# EAGLE design OLSD_Arduino_4B (EAGLE 5.10)
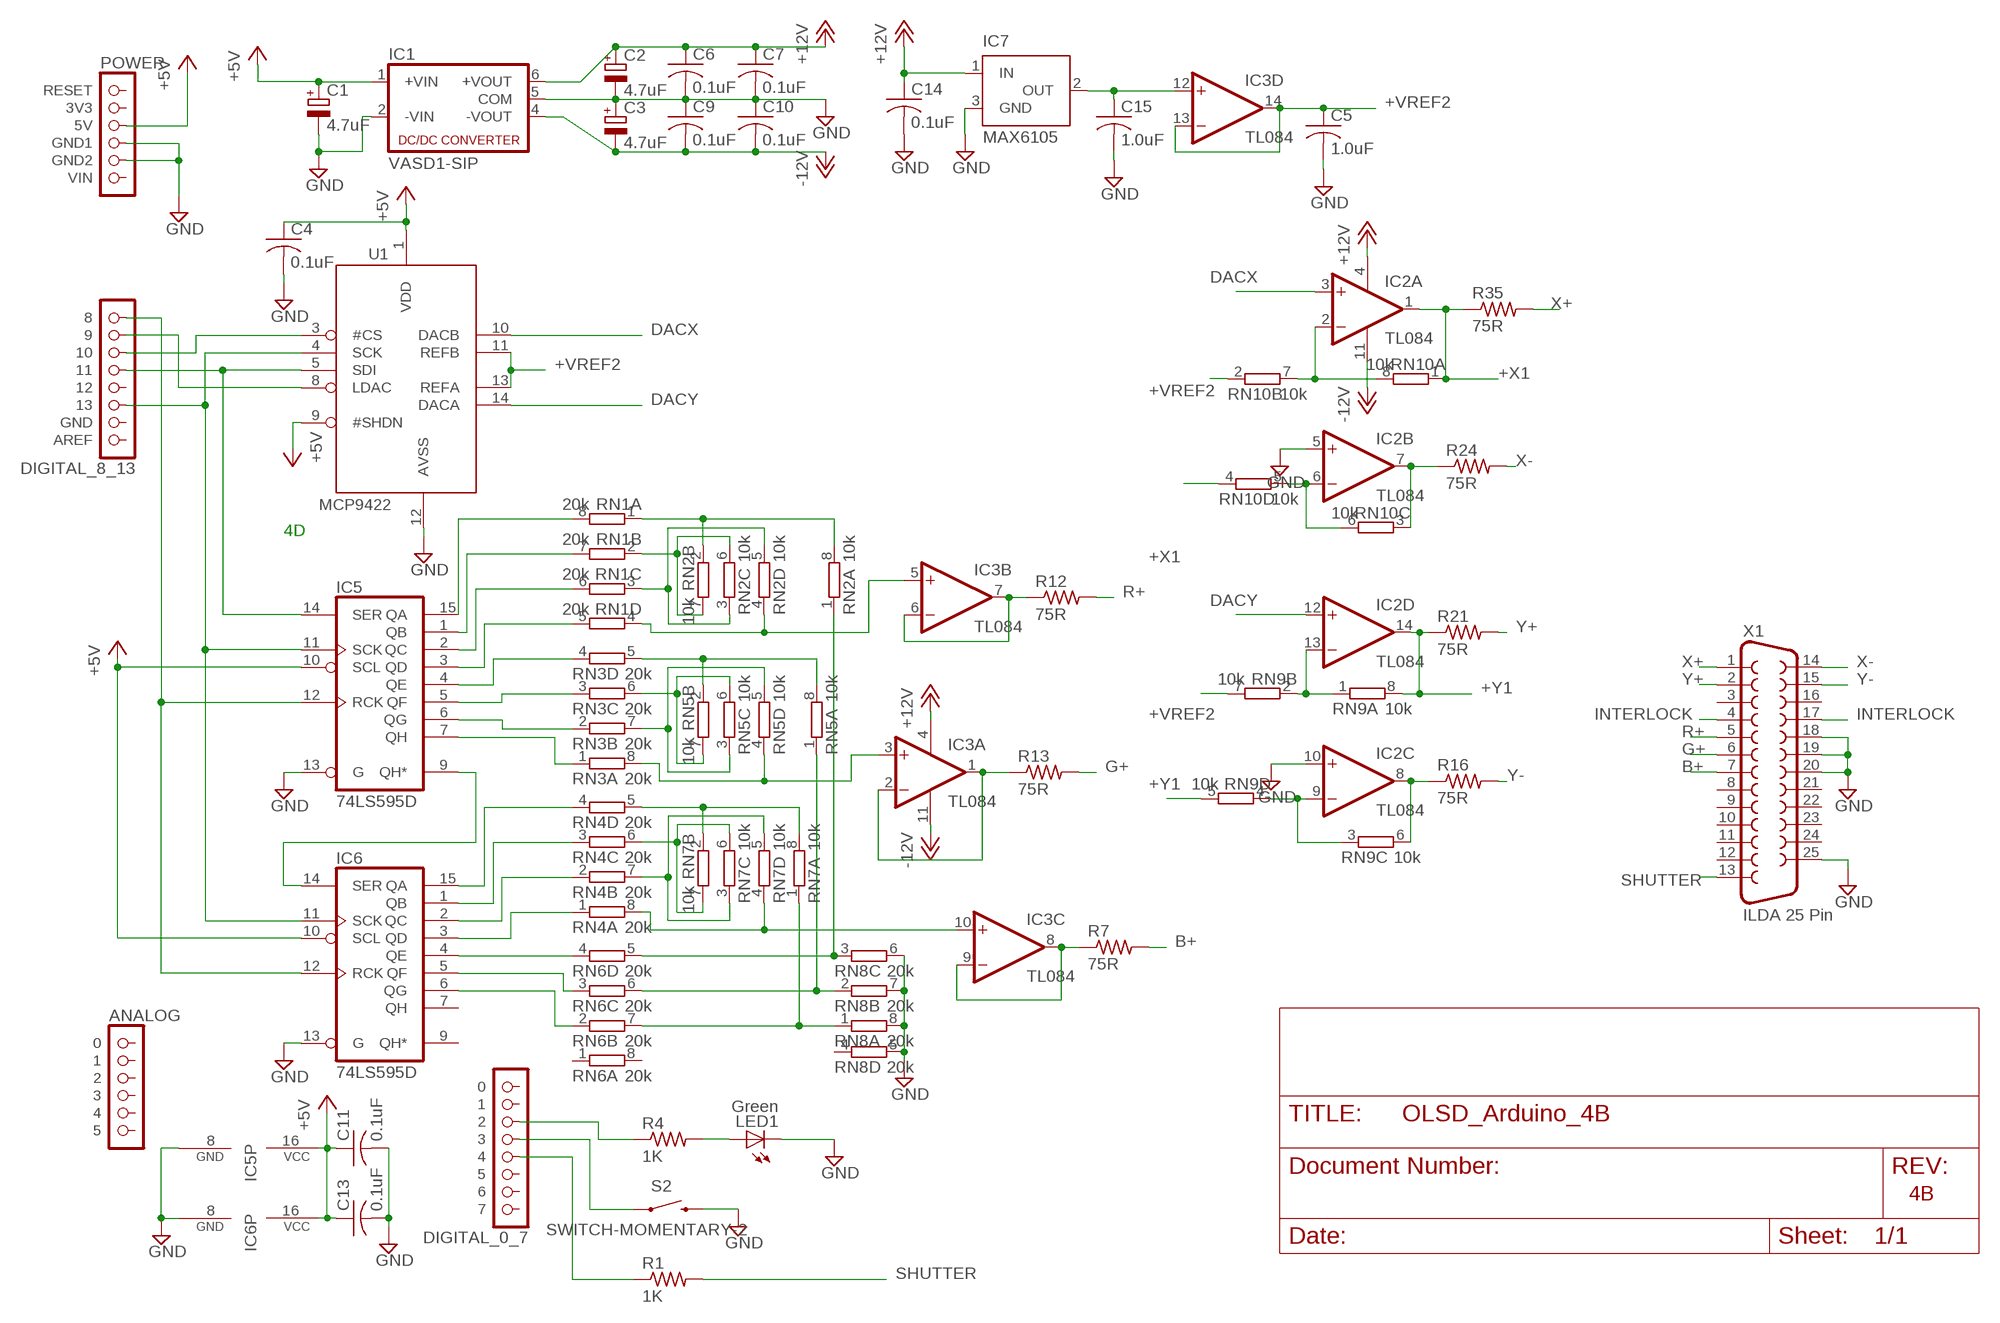
[diagram p0: schematic, sheet 1]

## Parts
C1  4.7uF  CPOL-EUE1.8-4  [E1,8-4]
C2  4.7uF  CPOL-EUE1.8-4  [E1,8-4]
C3  4.7uF  CPOL-EUE1.8-4  [E1,8-4]
C4  0.1uF  C-USC0603  [C0603]
C5  1.0uF  C-USC0603  [C0603]
C6  0.1uF  C-USC0603  [C0603]
C7  0.1uF  C-USC0603  [C0603]
C9  0.1uF  C-USC0603  [C0603]
C10  0.1uF  C-USC0603  [C0603]
C11  0.1uF  C-USC0603  [C0603]
C13  0.1uF  C-USC0603  [C0603]
C14  0.1uF  C-USC0603  [C0603]
C15  1.0uF  C-USC0603  [C0603]
IC1  VASD1-SIP  NMA  [NMA]
IC2  TL084  [SOIC-14]
IC3  TL084  [SOIC-14]
IC5  74LS595D  [SO16]
IC6  74LS595D  [SO16]
IC7  MAX6105  MAX6520  [SOT23]
LED1  Green  LED0603  [LED-0603]
R1  1K  R-US_R0603  [R0603]
R4  1K  R-US_R0603  [R0603]
R7  75R  R-US_R0603  [R0603]
R12  75R  R-US_R0603  [R0603]
R13  75R  R-US_R0603  [R0603]
R16  75R  R-US_R0603  [R0603]
R21  75R  R-US_R0603  [R0603]
R24  75R  R-US_R0603  [R0603]
R35  75R  R-US_R0603  [R0603]
RN1  20k  4R-NEXB38V  [EXB38V]
RN2  10k  4R-NEXB38V  [EXB38V]
RN3  20k  4R-NEXB38V  [EXB38V]
RN4  20k  4R-NEXB38V  [EXB38V]
RN5  10k  4R-NEXB38V  [EXB38V]
RN6  20k  4R-NEXB38V  [EXB38V]
RN7  10k  4R-NEXB38V  [EXB38V]
RN8  20k  4R-NEXB38V  [EXB38V]
RN9  10k  4R-NEXB38V  [EXB38V]
RN10  10k  4R-NEXB38V  [EXB38V]
S2  SWITCH-MOMENTARY-2  [TACTILE_SWITCH_TALL]
U1  MCP4922  [SOIC-14]
U$1  POWER  [1X06]
U$2  ANALOG  [1X06]
U$3  DIGITAL_0_7  [1X08]
U$4  DIGITAL_8_13  [1X08]
X1  ILDA 25 Pin  F25D  [F25D]

## Nets
#COLOR_LATCH: IC5.12(RCK) IC6.12(RCK) U$4.8
#CS_DAC: U1.3(#CS) U$4.6
#LDAC: U1.8(LDAC) U$4.7
+5V: C1.+ C4.1 C11.1 C13.1 IC1.1(+VIN) IC5.10(SCL) IC5.16(VCC) IC6.10(SCL) IC6.16(VCC) U1.1(VDD) U1.9(#SHDN) U$1.3(5V)
+12V: C2.+ C6.1 C7.1 C14.1 IC1.6(+VOUT) IC2.4(A:V+) IC3.4(A:V+) IC7.1(IN)
+VREF: C15.1 IC3.12(D:+IN) IC7.2(OUT)
+VREF2: C5.1 IC3.13(D:-IN) IC3.14(D:OUT) RN9.7 RN10.2 U1.11(REFB) U1.13(REFA)
+X1: IC2.1(A:OUT) R35.1 RN10.1 RN10.4
+Y1: IC2.14(D:OUT) R21.1 RN9.5 RN9.8
-12V: C3.- C9.2 C10.2 IC1.4(-VOUT) IC2.11(A:V-) IC3.11(A:V-)
B1+: IC3.8(C:OUT) IC3.9(C:-IN) R7.1
B+: R7.2 X1.7
DACX: IC2.3(A:+IN) U1.10(DACB)
DACY: IC2.12(D:+IN) U1.14(DACA)
G1+: IC3.1(A:OUT) IC3.2(A:-IN) R13.1
G+: R13.2 X1.6
GND: C1.- C2.- C3.+ C4.2 C5.2 C6.2 C7.2 C9.1 C10.1 C11.2 C13.2 C14.2 C15.2 IC1.2(-VIN) IC1.5(COM) IC2.5(B:+IN) IC2.10(C:+IN) IC5.8(GND) IC5.13(G) IC6.8(GND) IC6.13(G) IC7.3(GND) LED1.C RN8.5 RN8.6 RN8.7 RN8.8 S2.B2 U1.12(AVSS) U$1.4(GND1) U$1.5(GND2) X1.18 X1.19 X1.20 X1.25
INTERLOCK: X1.4 X1.17
MOSI: IC5.14(SER) U1.5(SDI) U$4.5
N$1: RN1.1 RN2.2 RN2.8
N$3: IC5.9(QH*) IC6.14(SER)
N$4: RN3.5 RN5.2 RN5.8
N$5: RN3.6 RN5.6 RN5.7
N$6: RN3.7 RN5.3 RN5.5
N$7: IC3.3(A:+IN) RN3.8 RN5.4
N$8: IC5.15(QA) RN1.8
N$9: IC5.1(QB) RN1.7
N$10: IC5.2(QC) RN1.6
N$11: IC5.3(QD) RN1.5
N$12: IC5.4(QE) RN3.4
N$13: R4.1 U$3.6
N$14: RN5.1 RN6.6 RN8.2
N$15: IC5.5(QF) RN3.3
N$16: IC5.6(QG) RN3.2
N$17: R1.1 U$3.4
N$18: IC3.10(C:+IN) RN4.8 RN7.4
N$20: LED1.A R4.2
N$23: RN1.2 RN2.6 RN2.7
N$24: RN1.3 RN2.3 RN2.5
N$26: IC6.15(QA) RN4.4
N$27: RN2.1 RN6.5 RN8.3
N$28: IC6.1(QB) RN4.3
N$29: IC6.2(QC) RN4.2
N$30: IC2.2(A:-IN) RN10.7 RN10.8
N$31: IC2.13(D:-IN) RN9.1 RN9.2
N$32: IC6.3(QD) RN4.1
N$33: S2.A2 U$3.5
N$34: RN4.5 RN7.2 RN7.8
N$35: IC2.6(B:-IN) RN10.5 RN10.6
N$36: IC2.9(C:-IN) RN9.3 RN9.4
N$37: RN4.6 RN7.6 RN7.7
N$38: RN4.7 RN7.3 RN7.5
N$39: IC3.5(B:+IN) RN1.4 RN2.4
N$42: IC6.4(QE) RN6.4
N$43: IC6.5(QF) RN6.3
N$44: IC6.6(QG) RN6.2
N$45: RN6.7 RN7.1 RN8.1
N$47: IC5.7(QH) RN3.1
R1+: IC3.6(B:-IN) IC3.7(B:OUT) R12.1
R+: R12.2 X1.5
SCK: IC5.11(SCK) IC6.11(SCK) U1.4(SCK) U$4.3
SHUTTER: R1.2 X1.13
X1-: IC2.7(B:OUT) R24.1 RN10.3
X+: R35.2 X1.1
X-: R24.2 X1.14
Y1-: IC2.8(C:OUT) R16.1 RN9.6
Y+: R21.2 X1.2
Y-: R16.2 X1.15
Unconnected: IC6.7(QH) IC6.9(QH*) RN6.1 RN6.8 RN8.4 U$1.1(RESET) U$1.2(3V3) U$1.6(VIN) U$2.1 U$2.2 U$2.3 U$2.4 U$2.5 U$2.6 U$3.1 U$3.2 U$3.3 U$3.7 U$3.8 U$4.1(AREF) U$4.2(GND) U$4.4 X1.3 X1.8 X1.9 X1.10 X1.11 X1.12 X1.16 X1.21 X1.22 X1.23 X1.24

## Notes on the sheet
- 4D
- 4B

## Library data of the parts
C1-C3 = rcl:CPOL-EU: POLARIZED CAPACITOR, European symbol
C4-C7 C9-C11 C13-C15 = adafruit:C-US: CAPACITOR, American symbol
IC1 = dc-dc-converter:NMA: DC-DC CONVERTER
IC2 IC3 = favreau:TL084: Texas Instruments TL084 JFET General Purpose Op-Amp
IC5 IC6 = 74xx-us:74*595: 8-bit SHIFT REGISTER, output latch
IC7 = maxim:MAX6520: 1.2V Voltage Reference 50ppm/°C, SOT23, 3-Terminal Source: http://datasheets.maxim-ic.com/en/ds/MAX6520.pdf
LED1 = SparkFun:LED: LEDs Standard schematic elements and footprints for 5mm, 3mm, 1206, and 0603 sized LEDs. 5mm - Spark Fun Electronics SKU : COM-00529 (and others)
R1 R4 R7 R12 R13 R16 R21 R24 R35 = resistor:R-US_: RESISTOR, American symbol
RN1-RN10 = resistor-dil:4R-N: Array Chip Resistor Source: RS Component / Phycomp
S2 = SparkFun:SWITCH-MOMENTARY-2
U1 = favreau:MCP4922
U$1 = arduino:POWER
U$2 = arduino:ANALOG
U$3 = arduino:DIGITAL_0_7
U$4 = arduino:DIGITAL_8_13
X1 = SparkFun:F25: D-SUB 25 25 Pin male connector. PCB edge mount for regular PCB thicknesses. This connector will connect directly to the back of a PC parallel port or through a normal DB25 extension cable (M/F). SKU: PRT-08287

## Board
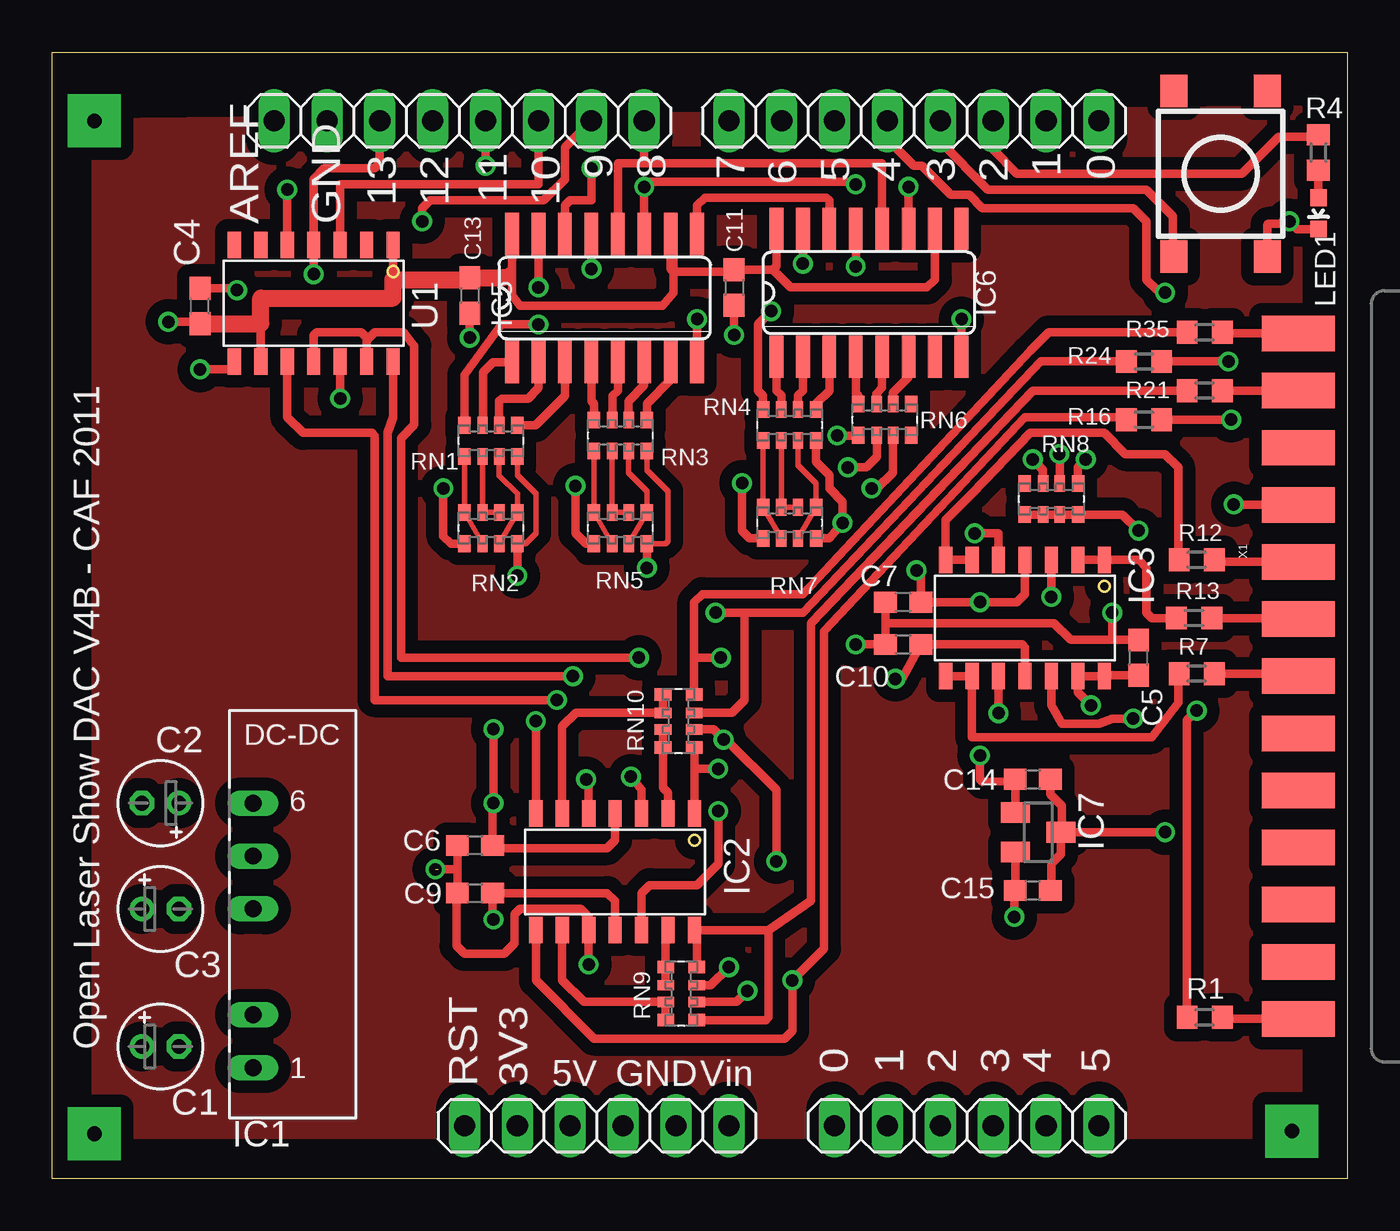
[diagram p1: board, top side]
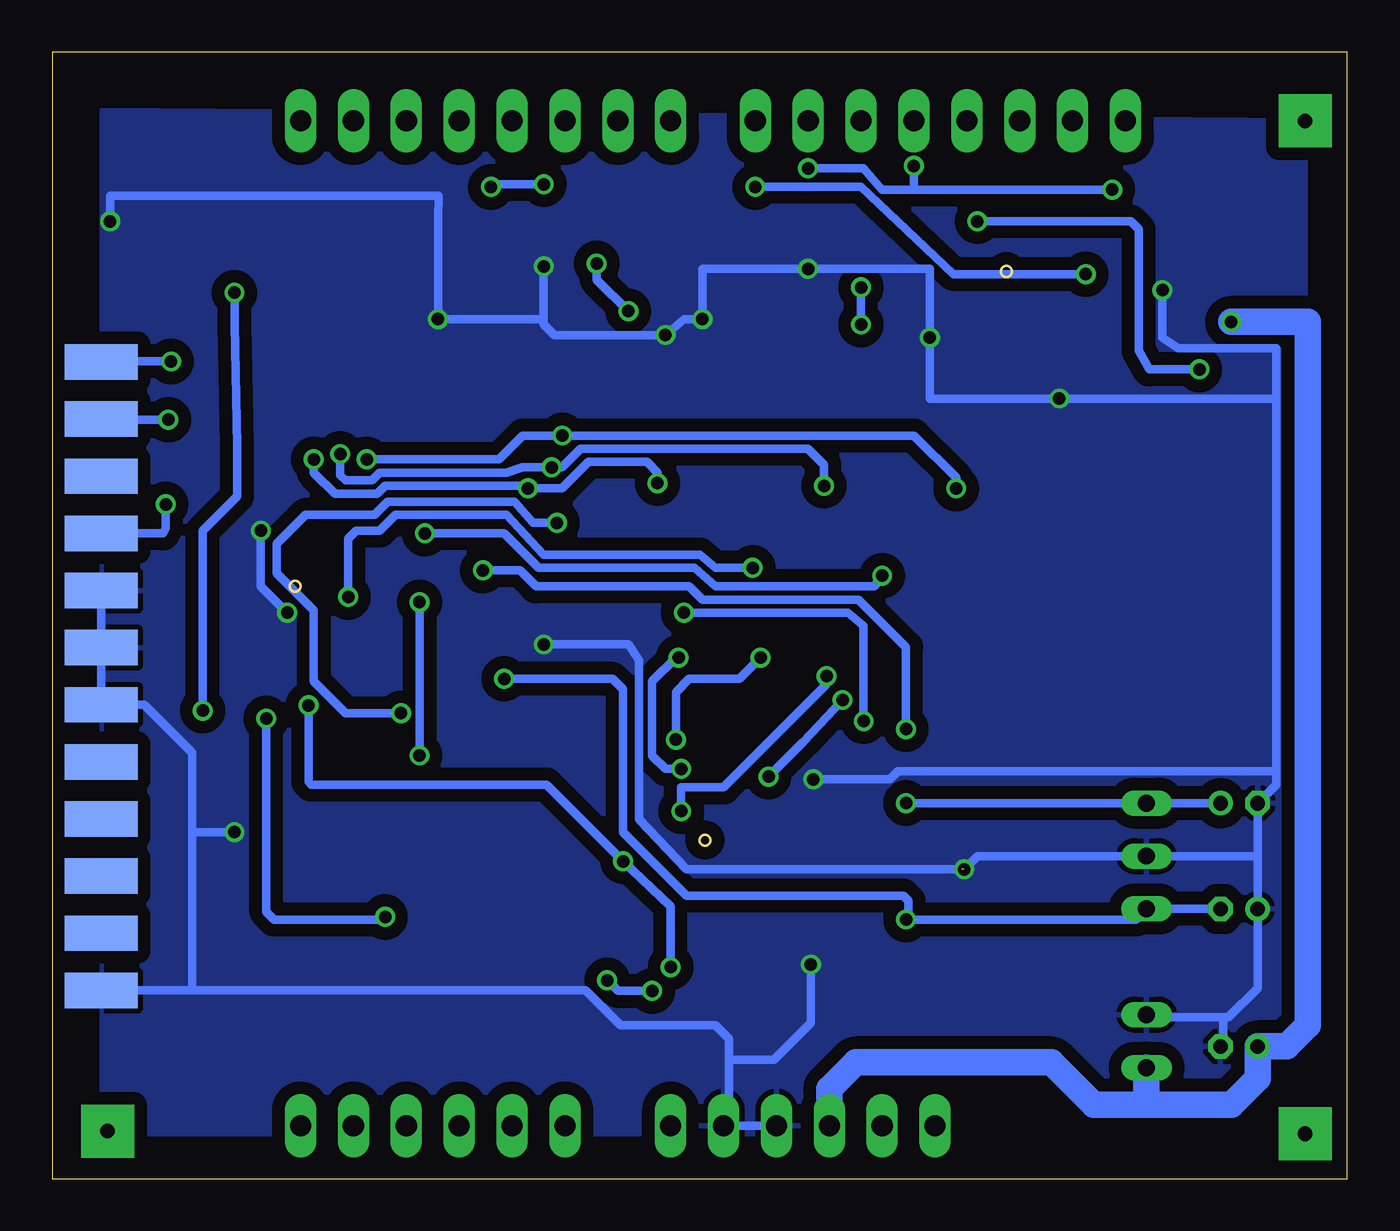
[diagram p2: board, bottom side, seen from below]

Size 62.23 x 54.1 mm. Coordinates in mm from the lower left corner, seen from the top.
Outline: 0,54.1 62.23,54.1 62.23,0 0,0 0,54.1
Copper layers (1*16): Top 0.0356mm / dielectric 1.5011mm / Bottom 0.0356mm
Design rules "LaenPCBOrder": minimum track width 6mil, minimum drill 13mil, track to track 6mil, track to pad 6mil, pad to pad 6mil, via to via 6mil, smd to smd 6mil, copper to edge 15mil, drill to drill 6mil, minimum pad ring 7mil, minimum via ring 7mil, stop-mask expansion 4mil, vias tented up to drill 0mil, thermal gap 10mil

### Footprints (pad centres in the part's own frame; a part is rotated, then mirrored left to right if it is on the bottom)
E1,8-4 = drill 0.711 pad 1.168 round: + -0.889,0 | drill 0.711 pad 1.168 octagon: - 0.889,0
C0603 = smd 1.1 x 1: 1 -0.85,0; 2 0.85,0
NMA = drill 0.813 long: 1 0,6.35; 2 0,3.81; 4 0,-1.27; 5 0,-3.81; 6 0,-6.35
SOIC-14 = smd 1.27 x 0.635: 1 -0.762,-0.508; 2 -0.762,-1.778; 3 -0.762,-3.048; 4 -0.762,-4.318; 5 -0.762,-5.588; 6 -0.762,-6.858; 7 -0.762,-8.128; 8 4.826,-8.128; 9 4.826,-6.858; 10 4.826,-5.588; 11 4.826,-4.318; 12 4.826,-3.048; 13 4.826,-1.778; 14 4.826,-0.508
SO16 = smd 0.66 x 2.032: 1 -4.445,-3.073; 2 -3.175,-3.073; 3 -1.905,-3.073; 4 -0.635,-3.073; 5 0.635,-3.073; 6 1.905,-3.073; 7 3.175,-3.073; 8 4.445,-3.073; 9 4.445,3.073; 10 3.175,3.073; 11 1.905,3.073; 12 0.635,3.073; 13 -0.635,3.073; 14 -1.905,3.073; 15 -3.175,3.073; 16 -4.445,3.073
SOT23 = smd 1 x 1.4: 1 -0.95,-1.1; 2 0.95,-1.1; 3 0,1.1
LED-0603 = smd 0.8 x 0.8: A 0,-0.75; C 0,0.75
R0603 = smd 1 x 1.1: 1 -0.85,0; 2 0.85,0
EXB38V = smd 0.6 x 0.8: 1 -1.275,-0.75; 4 1.275,-0.75; 5 1.275,0.75; 8 -1.275,0.75 | smd 0.5 x 0.8: 2 -0.4,-0.75; 3 0.4,-0.75; 6 0.4,0.75; 7 -0.4,0.75
TACTILE_SWITCH_TALL = smd 1.55 x 1.3: A1 -3.975,-2.25; A2 3.975,-2.25; B1 -3.975,2.25; B2 3.975,2.25
1X06 = drill 1.016 long: 1 -6.35,0; 2 -3.81,0; 3 -1.27,0; 4 1.27,0; 5 3.81,0; 6 6.35,0
1X08 = drill 1.016 long: 1 -8.89,0; 2 -6.35,0; 3 -3.81,0; 4 -1.27,0; 5 1.27,0; 6 3.81,0; 7 6.35,0; 8 8.89,0
F25D = smd 1.7 x 3.5: 1 -16.459,-6.045; 2 -13.716,-6.045; 3 -10.973,-6.045; 4 -8.23,-6.045; 5 -5.486,-6.045; 6 -2.743,-6.045; 7 0,-6.045; 8 2.743,-6.045; 9 5.486,-6.045; 10 8.23,-6.045; 11 10.973,-6.045; 12 13.716,-6.045; 13 16.459,-6.045 | smd 1.7 x 3.5 bottom: 14 -15.088,-6.045; 15 -12.344,-6.045; 16 -9.601,-6.045; 17 -6.858,-6.045; 18 -4.115,-6.045; 19 -1.372,-6.045; 20 1.372,-6.045; 21 4.115,-6.045; 22 6.858,-6.045; 23 9.601,-6.045; 24 12.344,-6.045; 25 15.088,-6.045

### Placement (x,y rotation side)
C1  5.21,6.35 0 top
C2  5.21,18.03 180 top
C3  5.21,12.95 0 top
C4  7.11,41.91 90 top
C5  52.2,25.02 90 top
C6  20.32,16 180 top
C7  40.89,27.69 180 top
C9  20.32,13.72 0 top
C10  40.89,25.65 0 top
C11  32.77,42.8 270 top
C13  20.07,42.42 270 top
C14  47.12,19.18 0 top
C15  47.12,13.84 0 top
IC1  9.65,11.68 180 top
IC2  31.37,16.76 270 top
IC3  51.05,28.96 270 top
IC5  26.54,42.29 0 top
IC6  39.24,42.55 0 top
IC7  47.37,16.64 270 top
LED1  60.83,46.35 180 top
R1  55.37,7.75 0 top
R4  60.83,49.28 270 top
R7  54.99,24.26 0 top
R12  54.99,29.72 0 top
R13  54.86,26.92 0 top
R16  52.45,36.45 0 top
R21  55.37,37.85 0 top
R24  52.45,39.24 0 top
R35  55.37,40.64 0 top
RN1  21.08,35.43 0 top
RN2  21.08,31.24 0 top
RN3  27.3,35.69 180 top
RN4  35.43,36.2 180 top
RN5  27.3,31.24 0 top
RN6  40.01,36.45 180 top
RN7  35.43,31.5 0 top
RN8  48.01,32.64 180 top
RN9  30.23,8.89 270 top
RN10  30.1,21.97 90 top
S2  56.13,48.26 270 top
U1  16.89,44.07 270 top
U$1  26.16,2.54 0 top
U$2  43.94,2.54 0 top
U$3  41.4,50.8 0 top
U$4  19.56,50.8 0 top
X1  65.91,24.13 270 top

### Tracks (layer width: path | path; a pad name or v marks a point on that pad's centre or on a via)
#COLOR_LATCH
  Top 0.406: 28.45,48.77 39.88,48.77 IC6.12 | 28.45,48.77 U$4.8 | 28.45,48.77 27.18,48.77 IC5.12
#CS_DAC
  Top 0.406: U1.3 13.84,47.75 23.37,47.75 U$4.6
#LDAC  (via drill 0.6)
  Top 0.406: 8.76,39.12 U1.8 8.76,38.86 v7.11,38.86 | U$4.7 24.64,49.53 24.64,48.01 23.62,46.99 18.16,46.99 17.78,46.61 v17.78,45.97
  Bottom 0.406: v17.78,45.97 10.41,45.97 10.03,45.59 10.03,39.75 9.53,38.86 v7.11,38.86
+5V  (via drill 0.6)
  Top 0.406: 21.68,43.27 22.1,43.69 IC5.16 22.1,42.42 22.48,41.91 29.34,41.91 29.84,42.55 29.84,43.56 | 34.63,43.65 C11.1 32.68,43.56 29.84,43.56 | 34.63,43.65 34.8,43.81 IC6.16 | v5.59,41.15 7.07,41.15 C4.1 | 29.84,43.56 29.84,45.24 IC5.10 29.72,43.69 29.84,43.56 | IC6.10 42.42,43.18 42.04,42.8 35.48,42.8 34.63,43.65 | 10.03,41.06 U1.9 | 16.38,43.18 U1.1 | 20.07,43.18 C13.1
  Top 0.813: C13.1 21.68,43.27 | C4.1 10.03,41.06 10.03,42.29 16.38,42.29 16.38,43.18 20.07,43.18
  Bottom 1.27: U$1.3 24.89,4.32 23.62,5.59 14.22,5.59 12.19,3.56 9.65,3.56 | 9.65,3.56 5.59,3.56 4.32,4.83 C1.+ 2.92,6.35 1.91,7.37 1.91,41.15 v5.59,41.15 | 9.65,3.56 IC1.1
+12V  (via drill 0.6)
  Top 0.406: C7.1 v44.58,27.69 46.35,27.69 46.74,28.07 IC3.4 | C7.1 41.78,27.6 | IC2.4 27.05,16.26 26.67,15.88 21.3,15.88 C6.1 21.17,18 v21.21,18.03 v21.21,21.59 | 46.27,18.67 IC7.1 | 46.27,18.67 C14.1 | v44.58,20.32 44.58,19.18 44.7,19.05 46.23,19.09 46.27,18.67 | C7.1 41.74,29 v41.53,29.21
  Bottom 0.406: C2.+ IC1.6 v21.21,18.03 | v21.21,21.59 21.21,25.53 23.5,27.81 30.99,27.81 31.62,28.45 38.99,28.45 39.75,29.21 v41.53,29.21 | v44.58,27.69 v44.58,20.32
+VREF  (via drill 0.6)
  Top 0.406: IC7.2 C15.1 46.23,13.8 v46.23,12.57 | IC3.12 48.01,22.73 48.51,21.84 50.29,21.84 50.93,22.1 v51.94,22.1
  Bottom 0.406: v51.94,22.1 51.94,12.83 51.56,12.45 46.35,12.45 v46.23,12.57
+VREF2  (via drill 0.6)
  Top 0.406: U1.11 12.57,40.51 12.7,40.64 14.86,40.64 15.11,40.39 U1.13 15.11,40.26 15.49,40.64 16.89,40.64 17.27,40.13 17.4,40.01 17.4,36.2 16.76,35.56 16.76,25.02 v28.19,25.02 | v49.91,22.73 49.28,23.37 IC3.13 IC3.14 50.55,24.17 C5.1 | RN10.2 31.77,21.57 v32.26,21.08 32.38,21.08 34.8,18.67 v34.8,15.24 | RN9.7 31.64,9.29 v32.51,10.16
  Bottom 0.406: v49.91,22.73 49.91,19.05 49.78,18.92 38.48,18.92 v34.8,15.24 32.51,13.08 v32.51,10.16 | 28.32,25.02 v28.19,25.02 29.21,24 31.62,24 32.26,23.37 v32.26,21.08
+X1  (via drill 0.6)
  Top 0.406: IC2.1 30.86,19.56 | 30.86,19.56 30.86,20.68 RN10.1 | R35.1 47.88,40.64 46.99,39.75 36.07,28.07 31.24,28.07 30.85,27.67 RN10.4 30.85,25.01 30.86,25.02 v32.13,25.02 | v32,19.68 30.99,19.68 30.86,19.56
  Bottom 0.406: v32.13,25.02 32.26,25.02 33.4,23.88 33.4,20.32 32.77,19.68 v32,19.68
+Y1
  Top 0.406: 34.42,11.94 IC2.14 30.98,11.94 RN9.8 | 34.42,11.94 36.45,13.34 36.45,26.67 47.12,37.85 R21.1 | RN9.5 34.28,7.62 34.42,7.75 34.42,11.94
-12V  (via drill 0.6)
  Top 0.406: IC3.11 46.74,25.53 46.61,25.65 C10.2 40.85,24.04 v40.51,24 | v21.21,12.45 21.17,12.48 C9.2 26.67,13.72 27.05,13.34 IC2.11
  Bottom 0.406: C3.- IC1.4 10.16,12.45 21.08,12.45 | 21.08,12.45 v21.21,12.45 | 21.08,12.45 21.08,13.34 21.34,13.59 31.75,13.59 34.8,16.64 34.8,23.5 35.31,24 v40.51,24
B1+
  Top 0.406: IC3.8 IC3.9 44.2,21.21 52.83,21.21 54.1,22.86 54.1,24.22 R7.1
B+
  Top 0.406: R7.2 59.74,24.26 X1.7
DACX  (via drill 0.6)
  Top 0.406: IC2.3 28.32,18.67 v27.81,19.3 | v24.26,22.99 15.49,22.99 15.49,35.69 15.37,35.81 12.06,35.81 11.3,36.58 U1.10
  Bottom 0.406: v27.81,19.3 26.16,20.95 v24.26,22.99
DACY  (via drill 0.6)
  Top 0.406: IC2.12 28.32,13.72 28.7,14.1 30.99,14.1 32,15.11 v32,17.65 | v25.02,24.13 16.13,24.13 16.13,35.81 16.38,36.58 U1.14
  Bottom 0.406: v32,17.65 32,18.8 29.97,18.8 25.02,23.75 v25.02,24.13
G1+
  Top 0.406: IC3.2 IC3.1 52.2,29.72 52.58,29.34 52.58,27.18 52.83,26.92 R13.1
G+
  Top 0.406: R13.2 59.82,26.92 X1.6
GND  (via drill 0.6)  (1 unrouted)
  Top 0.406: 40.04,26.54 C10.1 v38.61,25.65 | 40.04,26.54 C7.2 | 19.47,14.86 C9.1 19.43,13.68 19.43,11.18 19.81,10.79 21.72,10.79 22.23,11.3 22.23,12.7 22.48,12.95 25.4,12.95 25.78,12.57 IC2.10 v25.78,10.29 | 19.47,14.86 C6.2 | v18.41,14.86 19.47,14.86 | C4.2 8.8,42.76 v8.89,42.67 | v13.84,37.47 U1.12 | v20.07,40.39 C13.2 | v25.91,43.69 IC5.13 | v30.99,41.27 IC5.8 | v32.77,40.51 C11.2 | v38.61,43.81 IC6.13 | v43.69,41.27 IC6.8 | C14.2 47.97,18.45 48.51,17.91 48.51,16.76 | 48.51,16.76 48.51,16.68 IC7.3 48.47,15.58 48.01,15.11 48.01,13.88 C15.2 | 48.51,16.76 48.64,16.64 v53.47,16.64 | IC2.5 25.78,19.05 v25.65,19.18 | LED1.C 59.8,45.6 v59.44,45.97 59.31,45.85 58.42,45.85 58.38,45.81 S2.B2 | 50.8,25.87 48.93,25.87 48.13,26.67 40.17,26.67 40.04,26.54 | 50.8,25.87 C5.2 | v52.2,31.11 51.42,31.89 RN8.8 RN8.7 RN8.6 RN8.5 | v50.93,27.18 50.93,26 50.8,25.87
  Bottom 0.406: 18.54,14.86 31.75,14.86 34.04,17.27 34.04,24.89 34.54,25.65 v38.61,25.65 | C2.- 4.45,18.03 | 4.32,15.49 C3.+ 4.32,9.14 5.71,7.75 5.97,7.75 | 4.32,15.49 C2.- | 5.97,7.75 9.53,7.75 IC1.2 | 5.97,7.75 5.97,6.48 C1.- | 4.32,15.49 IC1.5 17.78,15.49 v18.41,14.86 | U$1.4 U$1.5 29.72,2.79 29.72,5.59 | X1.18 X1.19 X1.20 57.81,22.76 55.5,20.45 55.5,16.76 | v8.89,42.67 8.89,40.39 8.13,39.88 3.43,39.88 3.43,37.47 | 3.43,19.56 3.43,18.92 C2.- | 3.43,19.56 3.43,37.47 | 3.43,37.47 v13.84,37.47 20.07,37.47 v20.07,40.39 20.07,43.69 v25.91,43.69 30.99,43.69 v30.99,41.27 31.88,41.27 v32.77,40.51 38.1,40.51 38.61,41.02 38.61,41.15 | 38.61,41.15 v38.61,43.81 | 38.61,41.15 38.73,41.27 v43.69,41.27 43.69,46.1 43.65,47.21 59.44,47.21 v59.44,45.97 | 55.37,9.04 36.6,9.04 34.92,7.37 30.35,7.37 29.72,6.73 29.72,5.59 | 55.37,9.04 X1.25 | 55.37,9.04 55.5,9.17 55.5,16.76 | v53.47,16.64 55.37,16.64 55.5,16.76 | v25.78,10.29 25.78,7.49 27.56,5.71 29.59,5.71 29.72,5.59 | v25.65,19.18 21.97,19.18 21.59,19.56 3.43,19.56 | v52.2,31.11 52.2,28.45 v50.93,27.18
  pour Bottom (isolate 0.61): 2.03,50.8 2.03,2.16 59.82,2.16 59.82,51.31
INTERLOCK  (via drill 0.6)
  Top 0.406: X1.4 56.79,32.36 v56.77,32.38
  Bottom 0.406: v56.77,32.38 56.77,31.24 56.9,30.99 X1.17
MOSI  (via drill 0.6)
  Top 0.406: U1.5 v11.3,47.5 | v20.83,48.64 U$4.5 | IC5.14 24.64,46.74 24.89,46.99 25.91,46.99 v25.91,48.51
  Bottom 0.406: v11.3,47.5 20.83,47.5 | 20.83,47.5 v20.83,48.64 | 20.83,47.5 22.35,47.5 23.24,48.51 v25.91,48.51
N$1
  Top 0.254: RN1.1 RN2.8 RN2.2
N$2
  pour Top (isolate 0.61): 2.03,50.8 2.03,2.03 59.94,2.03 59.94,51.44
N$3
  Top 0.406: IC5.9 30.99,46.74 31.37,47.12 37.21,47.12 37.34,46.99 IC6.14
N$4
  Top 0.254: RN3.5 RN5.8 RN5.2
N$5
  Top 0.254: RN3.6 RN5.7 RN5.6
N$6
  Top 0.254: RN5.3 RN5.5 28.57,33.02 27.7,33.89 RN3.7
N$7  (via drill 0.6)
  Top 0.254: RN3.8 28.58,34.03 29.59,33.02 29.59,30.61 29.46,30.48 28.59,30.48 RN5.4
  Top 0.406: RN3.8 28.69,34.94 | v28.57,29.34 RN5.4 | v48.01,27.94 IC3.3
  Bottom 0.406: v28.57,29.34 30.35,29.34 31.11,29.97 38.61,29.97 40.39,31.88 45.72,31.88 46.48,31.11 47.62,31.11 48.01,30.73 v48.01,27.94
N$8  (via drill 0.6)
  Top 0.406: RN1.8 19.81,37.34 19.81,38.1 19.81,38.61 21.59,41.02 v23.37,41.02 | v23.37,42.8 IC5.15
  Bottom 0.406: v23.37,41.02 v23.37,42.8
N$9
  Top 0.406: IC5.1 21.18,39.22 20.7,38.73 20.7,36.2 RN1.7
N$10
  Top 0.406: RN1.6 21.48,37.36 21.59,37.47 22.86,37.47 23.37,37.97 IC5.2
N$11
  Top 0.406: RN1.5 23.23,36.18 24.64,37.59 IC5.3
N$12
  Top 0.406: IC5.4 25.91,37.34 26.03,37.22 RN3.4
N$13
  Top 0.406: 60.79,50.16 R4.1 60.74,50.04 58.93,50.04 57.15,48.26 46.35,48.26 45.21,49.4 U$3.6
N$14  (via drill 0.6)
  Top 0.406: RN5.1 25.64,30.49 25.15,30.99 v25.15,33.27 | v38.23,34.16 39.12,34.16 39.62,34.67 39.62,35.68 RN6.6 | RN8.2 48.41,34.78 v48.39,34.8
  Bottom 0.406: v25.15,33.27 25.15,34.29 25.91,35.05 36.83,35.05 37.72,34.16 v38.23,34.16 39.62,34.16 40.39,33.91 46.48,33.91 46.86,33.53 48.13,33.53 48.39,33.78 v48.39,34.8
N$15
  Top 0.406: IC5.5 27.18,37.85 26.92,37.59 26.92,36.46 RN3.3
N$16
  Top 0.406: IC5.6 28.45,38.1 27.69,37.34 27.69,36.46 RN3.2
N$17  (via drill 0.6)
  Top 0.406: R1.1 54.52,22.01 v54.99,22.48 | v53.47,42.55 53.09,42.67 52.58,43.18 52.58,45.97 51.94,46.61 44.7,46.61 44.07,47.24 43.18,47.24 41.78,48.64 41.4,48.64 40.13,49.91 U$3.4
  Bottom 0.406: v54.99,22.48 54.99,31.11 53.34,32.77 53.34,35.18 53.47,41.02 v53.47,42.55
N$18  (via drill 0.6)
  Top 0.406: RN7.4 37.35,30.75 v37.97,31.5 37.97,32.51 37.34,33.15 37.34,33.78 36.7,34.42 RN4.8 | v45.47,22.35 IC3.10
  Bottom 0.406: v37.97,31.5 39.12,31.5 40.01,32.51 46.1,32.51 46.74,31.88 50.04,31.88 51.44,30.48 51.44,29.08 49.66,27.3 49.66,23.88 48.13,22.35 v45.47,22.35
N$19  (via drill 0.7 pad 2.54)
  other vias: 2.03,50.8
N$20
  Top 0.406: LED1.A R4.2
N$21  (via drill 0.7 pad 2.54)
  other vias: 59.56,2.29
N$22  (via drill 0.7 pad 2.54)
  other vias: 2.03,2.16
N$23
  Top 0.254: RN1.2 RN2.7 RN2.6
N$24
  Top 0.254: RN1.3 21.48,33.76 22.35,32.89 RN2.5 RN2.3
N$26  (via drill 0.6)
  Top 0.406: v36.07,43.94 IC6.15 | v34.54,41.66 33.91,41.02 33.91,37.85 34.16,37.6 RN4.4
  Bottom 0.406: v36.07,43.94 36.07,43.18 v34.54,41.66
N$27  (via drill 0.6)
  Top 0.406: RN2.1 19.16,30.49 18.8,30.86 v18.8,33.15 | v37.72,35.69 38.72,35.69 RN6.5 | RN8.3 47.61,34.05 v47.12,34.54
  Bottom 0.406: v18.8,33.15 18.8,33.66 20.83,35.69 v37.72,35.69 39.62,35.69 40.77,34.54 v47.12,34.54
N$28
  Top 0.406: IC6.1 34.8,37.85 35.03,37.61 RN4.3
N$29
  Top 0.406: IC6.2 36.07,37.85 35.83,37.61 RN4.2
N$30
  Top 0.406: IC2.2 29.59,18.54 29.35,18.78 RN10.8 RN10.7
N$31
  Top 0.406: IC2.13 29.48,11.94 RN9.1 RN9.2
N$32
  Top 0.406: IC6.3 37.34,37.85 36.71,37.22 RN4.1
N$33
  Top 0.406: U$3.5 42.67,49.78 44.96,47.5 52.58,47.5 53.85,46.23 53.85,44.32 S2.A2
N$34
  Top 0.254: RN4.5 RN7.8 RN7.2
N$35
  Top 0.406: RN10.5 RN10.6 25.16,22.37 24.51,21.72 IC2.6
N$36
  Top 0.406: RN9.4 RN9.3 25.55,8.49 24.51,9.53 IC2.9
N$37
  Top 0.254: RN4.6 RN7.7 RN7.6
N$38
  Top 0.254: RN4.7 35.83,34.27 36.7,33.4 RN7.5 RN7.3
N$39  (via drill 0.6)
  Top 0.254: RN1.4 22.36,33.78 23.24,32.89 23.24,30.99 22.75,30.49 RN2.4
  Top 0.406: v22.35,28.96 RN2.4 | v44.32,30.99 45.47,30.99 IC3.5
  Bottom 0.406: v22.35,28.96 22.73,28.45 30.35,28.45 31.37,29.34 38.86,29.34 40.51,30.99 v44.32,30.99
N$42
  Top 0.406: RN6.4 38.73,37.6 38.61,37.72 IC6.4
N$43
  Top 0.406: RN6.3 39.6,37.7 39.88,37.97 IC6.5
N$44
  Top 0.406: RN6.2 40.41,37.74 41.15,38.48 IC6.6
N$45  (via drill 0.6)
  Top 0.406: RN7.1 33.52,30.75 33.15,31.11 v33.15,33.4 | v39.37,33.15 39.62,33.15 40.39,33.91 40.39,35.68 RN6.7 | RN8.1 49.28,34.17 v49.66,34.54
  Bottom 0.406: v33.15,33.4 33.15,33.91 33.66,34.42 36.45,34.42 37.72,33.15 v39.37,33.15 39.5,33.27 46.23,33.27 46.61,32.89 48.64,32.89 49.66,33.91 v49.66,34.54
N$47
  Top 0.406: IC5.7 29.72,38.35 28.57,37.21 RN3.1
R1+
  Top 0.406: IC3.6 IC3.7 42.93,31.62 44.2,32.89 46.99,35.81 50.55,35.81 51.56,34.8 53.47,34.8 54.1,34.16 54.1,29.76 R12.1
R+
  Top 0.406: X1.5 55.94,29.62 R12.2
SCK  (via drill 0.6)
  Top 0.406: U$4.3 15.75,48.77 15.49,48.51 13.08,48.51 12.57,48.01 U1.4 v12.57,43.43 | v38.61,47.75 38.48,47.88 28.7,47.88 v28.45,47.62 IC5.11 | v41.15,47.62 IC6.11
  Bottom 0.406: v38.61,47.75 41.02,47.75 v41.15,47.62 | v28.45,47.62 23.37,47.62 18.92,43.43 v12.57,43.43
SHUTTER
  Top 0.406: X1.13 56.42,7.67 56.35,7.75 R1.2
X1-  (via drill 0.6)
  Top 0.406: v31.88,27.18 33.15,27.18 | 33.15,27.18 36.07,27.18 47.5,39.24 R24.1 | IC2.7 v23.24,21.97 | RN10.3 32.66,22.37 33.27,22.99 33.27,27.05 33.15,27.18
  Bottom 0.406: v31.88,27.18 24,27.18 23.24,26.54 v23.24,21.97
X+
  Top 0.406: X1.1 56.27,40.59 R35.2
X-  (via drill 0.6)
  Top 0.406: R24.2 v56.52,39.24
  Bottom 0.406: v56.52,39.24 59.87,39.24 X1.14
Y1-  (via drill 0.6)
  Top 0.406: RN9.6 32.87,8.49 v33.4,9.02 | IC2.8 23.24,9.53 26.04,6.73 35.18,6.73 35.56,7.11 v35.56,9.53 37.08,11.05 37.08,26.29 46.74,36.58 51.44,36.58 51.56,36.45 R16.1
  Bottom 0.406: v33.4,9.02 35.05,9.02 v35.56,9.53
Y+
  Top 0.406: R21.2 X1.2
Y-  (via drill 0.6)
  Top 0.406: R16.2 v56.64,36.45
  Bottom 0.406: v56.64,36.45 59.87,36.45 X1.15

### Text on the board
tNames: 9 | 8 | 7 | 6 | 5 | 4 | 3 | 2 | 1 | 0 | 13 | 12 | 11 | 10 | AREF | GND | Open Laser Show DAC V4B - CAF 2011 | 0 | 1 | 2 | 3 | 4 | 5 | RST | 3V3 | 5V | GND | Vin
TallParts: USB | ISP | PWR
ArduinoHoles: 3.2mm | 2.2mm | 3.2mm